# EAGLE design untitled (EAGLE 5.11)
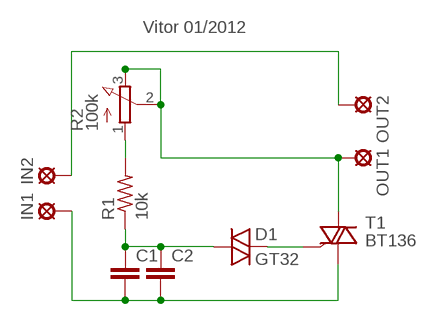
[diagram p0: schematic, sheet 1]

## Parts
C1  C-EU025-024X044  [C025-024X044]
C2  C-EU025-024X044  [C025-024X044]
D1  GT32  [GT32]
IN1  In1  LSP11  [LSP11]
IN2  In2  LSP11  [LSP11]
OUT1  Out1  LSP11  [LSP11]
OUT2  Out2  LSP11  [LSP11]
R1  10k  R-US_0207/7  [0207/7]
R2  100k  3RP/1610N  [3RP/1610N]
T1  BT136  [TO220AB]

## Nets
N$1: C1.2 C2.2 IN1.MP T1.1(A1)
N$2: C1.1 C2.1 D1.1 R1.1
N$3: OUT1.MP R2.2(S) R2.3(E) T1.2(A2)
N$4: R1.2 R2.1(A)
N$5: D1.2 T1.3(G)
N$6: IN2.MP OUT2.MP

## Notes on the sheet
- Vitor 01/2012

## Library data of the parts
C1 C2 = rcl:C-EU: CAPACITOR, European symbol
D1 = diode:GT32: Trigger DIODE
IN1 IN2 OUT1 OUT2 = solpad:LSP11: SOLDER PAD drill 1.1 mm
R1 = rcl:R-US_: RESISTOR, American symbol
R2 = pot:3RP/1610N: 16mm Potentiometer one level Source: http://www.alphapotentiometers.net/html/16mm_pot_2.html
T1 = triac:BT136: Triac BT136 series E sensitive gate Source: http://www.nxp.com/acrobat_download/datasheets/BT136_SERIES_E_2.pdf

## Board
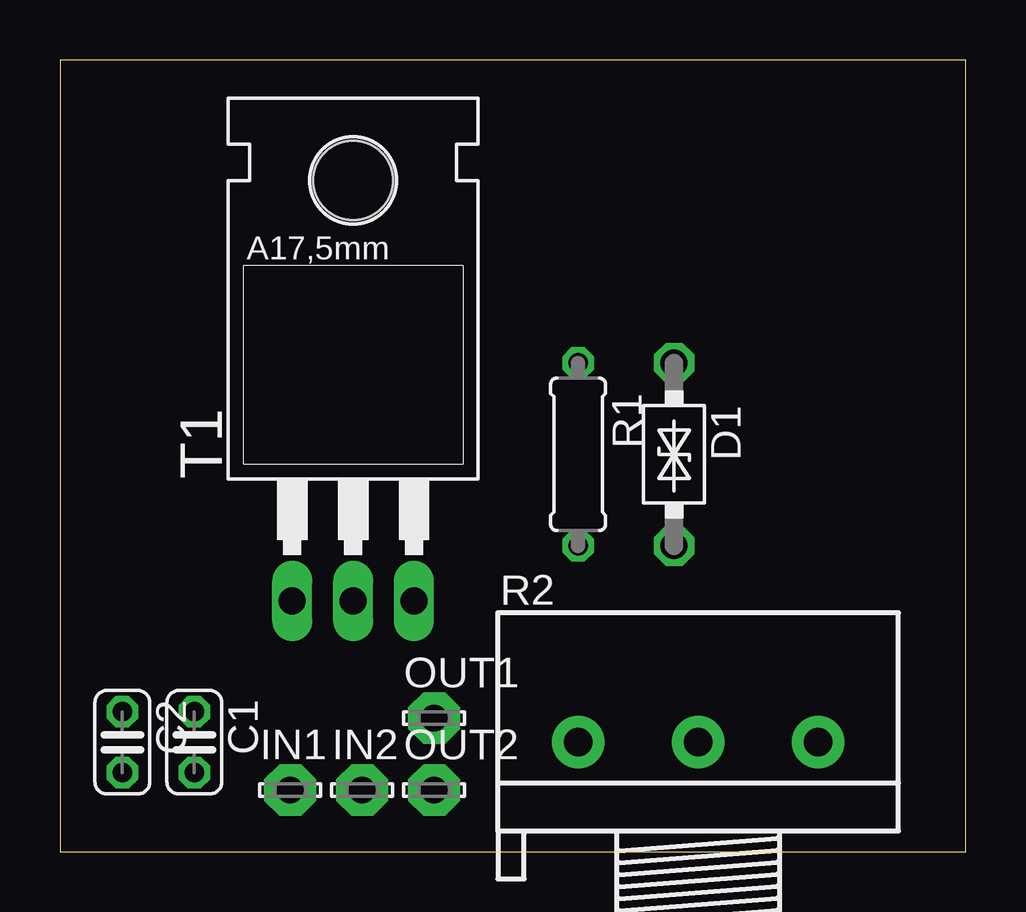
[diagram p1: board, top side]
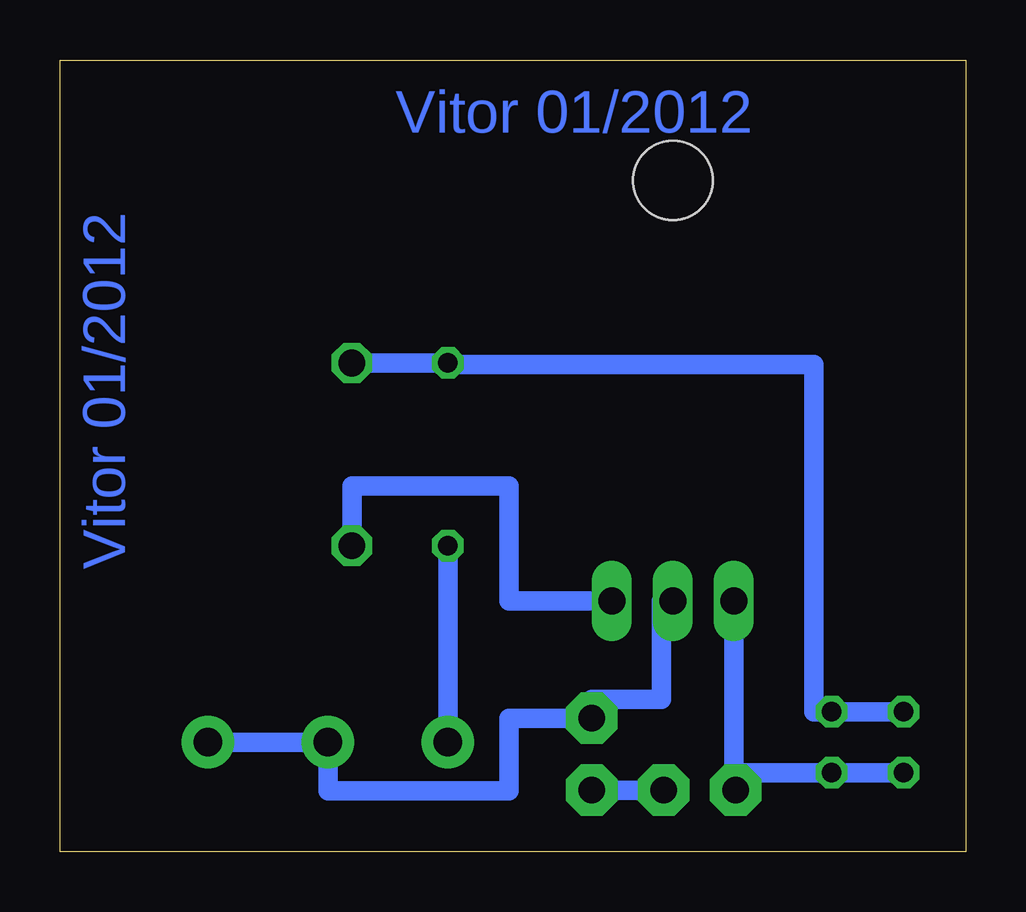
[diagram p2: board, bottom side, seen from below]

Size 37.77 x 33.01 mm. Coordinates in mm from the lower left corner, seen from the top.
Outline: 0,0 37.77,0 37.77,33.01 0,33.01 0,0
Copper layers (1*16): Top 0.035mm / dielectric 1.5mm / Bottom 0.035mm
Design rules "default *": minimum track width 10mil, minimum drill 24mil, track to track 10mil, track to pad 10mil, pad to pad 10mil, via to via 10mil, smd to smd 10mil, copper to edge 40mil, drill to drill 8mil, minimum pad ring 10mil, minimum via ring 8mil, stop-mask expansion 4mil, vias tented up to drill 0mil, thermal gap 10mil

### Footprints (pad centres in the part's own frame; a part is rotated, then mirrored left to right if it is on the bottom)
C025-024X044 = drill 0.813 octagon: 1 -1.27,0; 2 1.27,0
GT32 = drill 1.118 octagon: 1 -3.81,0; 2 3.81,0
LSP11 = drill 1.118 pad 2.159 octagon: MP 0,0
0207/7 = drill 0.813 octagon: 1 -3.81,0; 2 3.81,0
3RP/1610N = drill 1.2 pad 2.184 round: 1 -5,0; 2 0,0; 3 5,0
TO220AB = drill 1.118 long: 1 -2.54,-6.35; 2 0,-6.35; 3 2.54,-6.35 | hole 3.302: 0,11.176

### Placement (x,y rotation side)
C1  5.6,4.57 270 top
C2  2.6,4.57 270 top
D1  25.6,16.57 270 top
IN1  9.6,2.57 0 top
IN2  12.6,2.57 0 top
OUT1  15.6,5.57 0 top
OUT2  15.6,2.57 0 top
R1  21.6,16.57 270 top
R2  26.6,4.57 0 top
T1  12.22,16.81 0 top

### Tracks (layer width: path | path; a pad name or v marks a point on that pad's centre or on a via)
N$1
  Bottom 0.813: C2.2 C1.2 9.6,3.3 IN1.MP 9.68,2.57 T1.1
N$2
  Bottom 0.813: C2.1 C1.1 6.35,5.84 6.35,20.32 21.6,20.32 R1.1 D1.1
N$3
  Bottom 0.813: T1.2 12.7,10.46 12.7,6.35 15.6,6.35 OUT1.MP 19.05,5.57 19.05,2.54 26.6,2.54 R2.2 R2.3
N$4
  Bottom 0.813: R2.1 R1.2
N$5
  Bottom 0.813: T1.3 19.05,10.46 19.05,15.24 25.6,15.24 D1.2
N$6
  Bottom 0.813: IN2.MP OUT2.MP

### Text on the board
Bottom: Vitor 01/2012 | Vitor 01/2012